# Altium schematic sheet connectorB.SchDoc
size A4
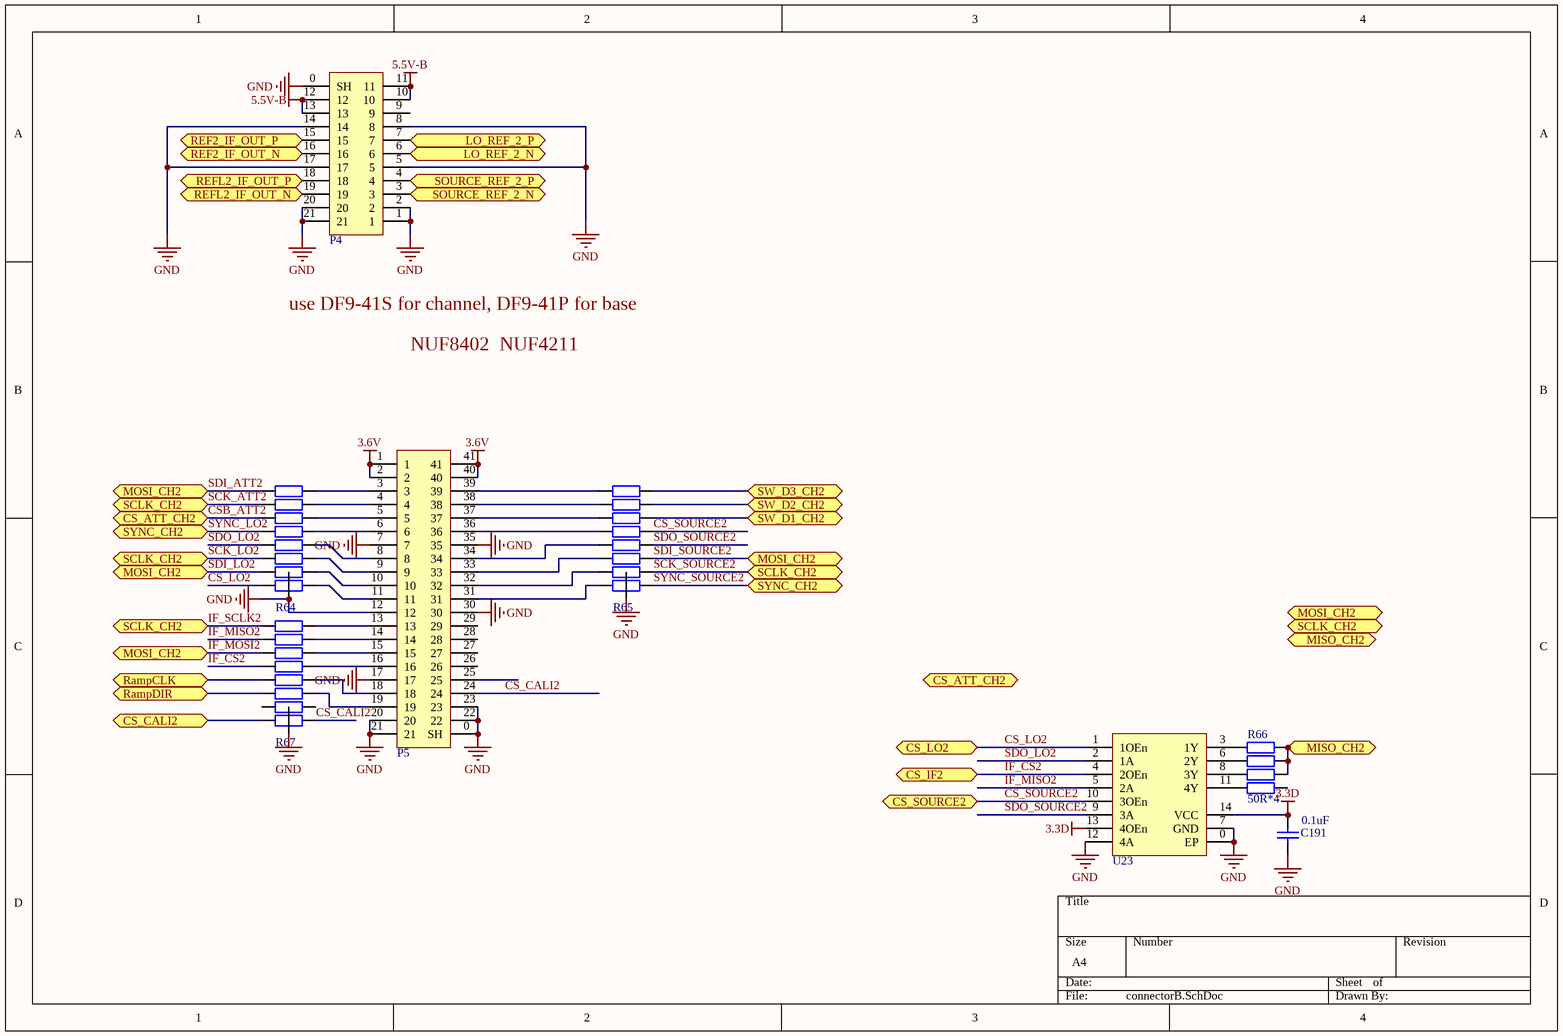
[diagram p0: connectorB.SchDoc]

## Parts
C191  0.1uF  [0402]
P4  DF9-21  [DF9-21P]  (value not drawn)
P5  DF9-41S  [VNA_CHANNEL]  (value not drawn)
R64  NUF8xxx  [NUF8xxx]  (value not drawn)
R65  NUF8xxx  [NUF8xxx]  (value not drawn)
R66  50R*4  [0402X4]
R67  NUF8xxx  [NUF8xxx]  (value not drawn)
U23  74-125-FUNC  [74LVC125ABQ]  (value not drawn)

## Ports
CS_ATT_CH2, CS_CALI2, CS_IF2, CS_LO2, CS_SOURCE2, LO_REF_2_N, LO_REF_2_P, MISO_CH2, MOSI_CH2, RampCLK, RampDIR, REF2_IF_OUT_N, REF2_IF_OUT_P, REFL2_IF_OUT_N, REFL2_IF_OUT_P, SCLK_CH2, SOURCE_REF_2_N, SOURCE_REF_2_P, SW_D1_CH2, SW_D2_CH2, SW_D3_CH2, SYNC_CH2

## Nets
3.3D: C191.2 U23.13(4OEn) U23.14(VCC)
3.6V: P5.1 P5.2 P5.40 P5.41
5.5V-B: P4.10 P4.11 P4.12 P4.13
GND: C191.1 P4.0(SH) P4.1 P4.2 P4.5 P4.8 P4.14 P4.17 P4.20 P4.21 P5.0(SH) P5.7 P5.12 P5.17 P5.20 P5.21 P5.22 P5.23 P5.30 P5.35 R64.0 R65.0 R67.0 U23.0(EP) U23.7(GND) U23.12(4A)
CS_CALI2: P5.24 R67.8
CS_CALI2: R67.9 ; port CS_CALI2  [a separate net that carries the same name]
CS_LO2: R64.9 U23.1(1OEn) ; port CS_LO2
CS_SOURCE2: R65.4 U23.10(3OEn) ; port CS_SOURCE2
CSB_ATT2: R64.14 ; port CS_ATT_CH2
IF_CS2: R67.13 U23.4(2OEn) ; port CS_IF2
IF_MISO2: R67.15 U23.5(2A)
IF_MOSI2: R64.10 R64.16 R65.6 R67.14 ; port MOSI_CH2  [also labelled SDI_ATT2, SDI_LO2, SDI_SOURCE2]
IF_SCLK2: R64.11 R64.15 R65.7 R67.16 ; port SCLK_CH2  [also labelled SCK_ATT2, SCK_LO2, SCK_SOURCE2]
LO_REF_2_N: P4.6 ; port LO_REF_2_N
LO_REF_2_P: P4.7 ; port LO_REF_2_P
MISO_CH2: R66.6 R66.7 R66.8 ; port MISO_CH2
RampCLK: R67.12 ; port RampCLK
RampDIR: R67.11 ; port RampDIR
REF2_IF_OUT_N: P4.16 ; port REF2_IF_OUT_N
REF2_IF_OUT_P: P4.15 ; port REF2_IF_OUT_P
REFL2_IF_OUT_N: P4.19 ; port REFL2_IF_OUT_N
REFL2_IF_OUT_P: P4.18 ; port REFL2_IF_OUT_P
SDO_LO2: R64.12 U23.2(1A)
SDO_SOURCE2: R65.5 U23.9(3A)
SOURCE_REF_2_N: P4.3 ; port SOURCE_REF_2_N
SOURCE_REF_2_P: P4.4 ; port SOURCE_REF_2_P
SW_D1_CH2: R65.3 ; port SW_D1_CH2
SW_D2_CH2: R65.2 ; port SW_D2_CH2
SW_D3_CH2: R65.1 ; port SW_D3_CH2
SYNC_LO2: R64.13 R65.8 ; port SYNC_CH2  [also labelled SYNC_SOURCE2]
NetP5_3: P5.3 R64.1
NetP5_4: P5.4 R64.2
NetP5_5: P5.5 R64.3
NetP5_6: P5.6 R64.4
NetP5_8: P5.8 R64.5
NetP5_9: P5.9 R64.6
NetP5_10: P5.10 R64.7
NetP5_11: P5.11 R64.8
NetP5_13: P5.13 R67.1
NetP5_14: P5.14 R67.2
NetP5_15: P5.15 R67.3
NetP5_16: P5.16 R67.4
NetP5_18: P5.18 R67.5
NetP5_19: P5.19 R67.6
NetP5_31: P5.31 R65.9
NetP5_32: P5.32 R65.10
NetP5_33: P5.33 R65.11
NetP5_34: P5.34 R65.12
NetP5_36: P5.36 R65.13
NetP5_37: P5.37 R65.14
NetP5_38: P5.38 R65.15
NetP5_39: P5.39 R65.16
NetR66_1: R66.1 U23.3(1Y)
NetR66_2: R66.2 U23.6(2Y)
NetR66_3: R66.3 U23.8(3Y)
NetR66_4: R66.4 U23.11(4Y)

Not connected (* = marked no-connect by the designer): P4 9; P5 25 26 27 28 29; R66 5; R67 7 10

## Notes on the sheet
- use DF9-41S for channel, DF9-41P for base
- NUF8402  NUF4211

## Library data of the parts
C191 = Cap: Capacitor
R66 = Res*4: Resistor; Published: 8-Jun-2000; LatestRevisionDate: 17-Jul-2002; LatestRevisionNote: Re-released for DXP Platform.; PackageReference: AXIAL-0.4; Publisher: Altium Limited; PackageDescription: Axial Device, Thru-Hole; 2 Leads; 0.4 in Pin Spacing